# Altium schematic sheet Main.SchDoc
size A; SheetNumber: 1; SheetTotal: 8
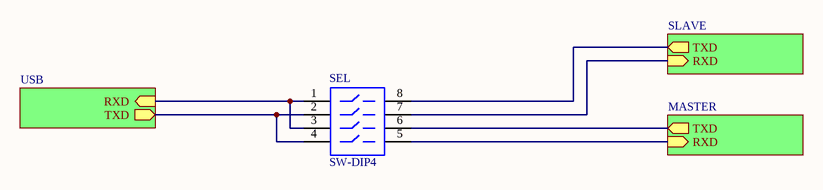
[diagram p0: Main.SchDoc]

## Parts
SEL  SW-DIP4  [DIPSW-4-SMD]

## Sub-sheets
MASTER = MASTER.SchDoc: RXD (in), TXD (out)
SLAVE = SLAVE.SchDoc: RXD (in), TXD (out)
USB = ft232.SchDoc: RXD (in), TXD (out)

## Nets
NetSEL_1: SEL.1 SEL.3 ; sheet USB/RXD
NetSEL_2: SEL.2 SEL.4 ; sheet USB/TXD
NetSEL_5: SEL.5 ; sheet MASTER/RXD
NetSEL_6: SEL.6 ; sheet MASTER/TXD
NetSEL_7: SEL.7 ; sheet SLAVE/RXD
NetSEL_8: SEL.8 ; sheet SLAVE/TXD

## Library data of the parts
SEL = SW-DIP4: DIP Switch; Published: 24-Mar-1999; LatestRevisionDate: 17-Jul-2002; LatestRevisionNote: Re-released for DXP Platform.; PackageReference: DIP-8; Publisher: Altium Limited